# Altium schematic sheet Top_Level.SchDoc
size 297 x 209 mm; SheetNumber: 1; SheetTotal: 4
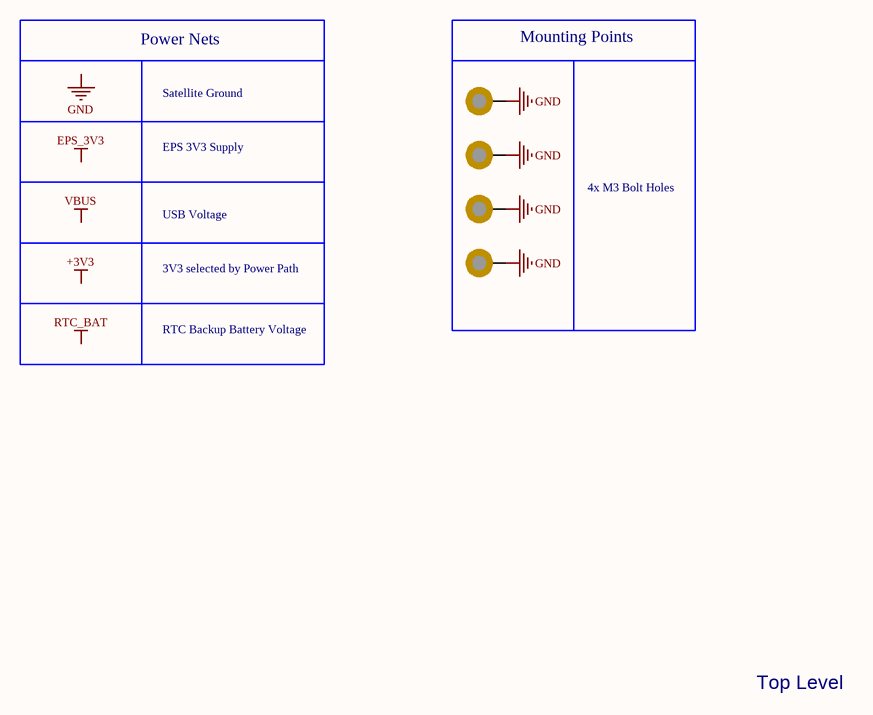
[diagram p0: Top_Level.SchDoc]

## Parts
MECH1  M3 Mounting Hole  [M3 Mounting Hole]  (value not drawn)  (no BOM)
MECH2  M3 Mounting Hole  [M3 Mounting Hole]  (value not drawn)  (no BOM)
MECH3  M3 Mounting Hole  [M3 Mounting Hole]  (value not drawn)  (no BOM)
MECH4  M3 Mounting Hole  [M3 Mounting Hole]  (value not drawn)  (no BOM)

## Nets
GND: MECH1.1 MECH2.1 MECH3.1 MECH4.1

## Notes on the sheet
- Power Nets
- Mounting Points
- Satellite Ground
- EPS 3V3 Supply
- 4x M3 Bolt Holes
- USB Voltage
- 3V3 selected by Power Path
- RTC Backup Battery Voltage
- Top Level
- Labels drawn without touching a wire or pin: +3V3, EPS_3V3, GND, RTC_BAT, VBUS
- Size:
- Title:
- A4
- Project:
- Rev:
- Date:
- Drawn By:
- Sheet:
- of